# Altium project RedundantWirelessNode.PrjPcb
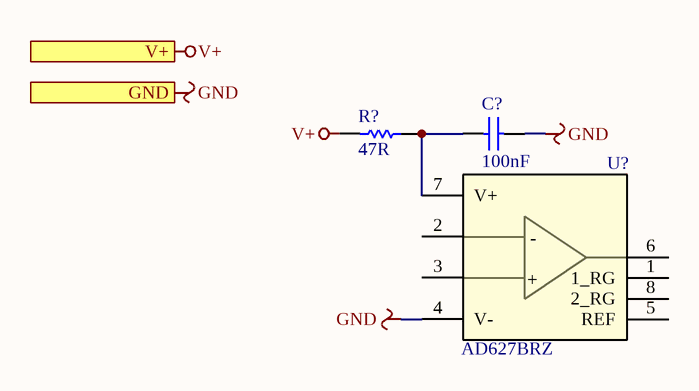
[diagram p0: Thermocouple channel.SchDoc]
7 sheets, 175 parts. Net scope: strictly hierarchical (ports join the sheet entries above them; power ports are local).
Sheets:
  Thermocouple channel.SchDoc
  Battery_2CELL.SchDoc
  TOP.SchDoc
    U_MCU = MCU.SchDoc
    U_MCU = MCU.SchDoc
    U_Battery_1CELL = Battery_1CELL.SchDoc
    U_Battery_1CELL = Battery_1CELL.SchDoc
  AblationChannel.SchDoc
  Analog.SchDoc

## Sheet Thermocouple channel.SchDoc
size A4

### Parts
(Parts that share a designator on the sheet are numbered #1, #2 ... from top to bottom, then left to right.)
C?#1  100nF  [S0603C]
R?#1  47R  [S0603R]
U?#1  AD627BRZ  [SOP-8_150mil]

### Ports
GND, V+

### Nets
GND: C?#1.1 U?#1.4(V-) ; port GND
V+: R?#1.2 ; port V+
NetC?#1_2: C?#1.2 R?#1.1 U?#1.7(V+)

Not connected (* = marked no-connect by the designer): U?#1 1(1_RG) 2(VIN-) 3(VIN+) 5(REF) 6(VOUT) 8(2_RG)

### Notes on the sheet
- (in symbol AD627BRZ) +

### Library data of the parts
C?#1 = 100nF/0603/50V: 精度 ±10% / 容值 100nF / 额定电压 50V / 温漂系数（介质材料) X7R; Manufacturer: FH(风华); A_Manufacturer: 元六; Code: 0603B104K500NT; A_Code: J CT41-0603-2R1-50V-104K; CompType: Capacitor; A_ComType: 二类电容; DistributorCode: C30926; Package: 0603
R?#1 = 47R/0603: 精度 ±1% / 温度系数 ±100ppm/℃ / 阻值 47Ω / 功率 0.1W; Manufacturer: FH(风华); A_Manufacturer: 718; Code: RS-03K47R0FT; A_Code: J-RM1608(0603)-K-B-47R-F; CompType: Resistor; A_ComType: RM型片式膜固定电阻器; DistributorCode: C140087; Package: 0603
U?#1 = AD627BRZ: 增益带宽积（GBP） 80kHz(-3dB) / 放大器组数 1 / 输出类型 Rail-to-Rail / 运放类型 Instrumentation / 各通道功耗 - / 压摆率（SR） 0.06 V/us / 工作温度 -40℃~85℃ / 电源电压 2.2V ~ 36V, ±1.1V ~ 18V; Manufacturer: TI(德州仪器); CompType: 运放; DistributorCode: C19137; Package: SOIC-8_150mil; Code: AD627BRZ; A_Code: -; A_Manufacturer: -; A_ComType: -

## Sheet Battery_2CELL.SchDoc
size A4
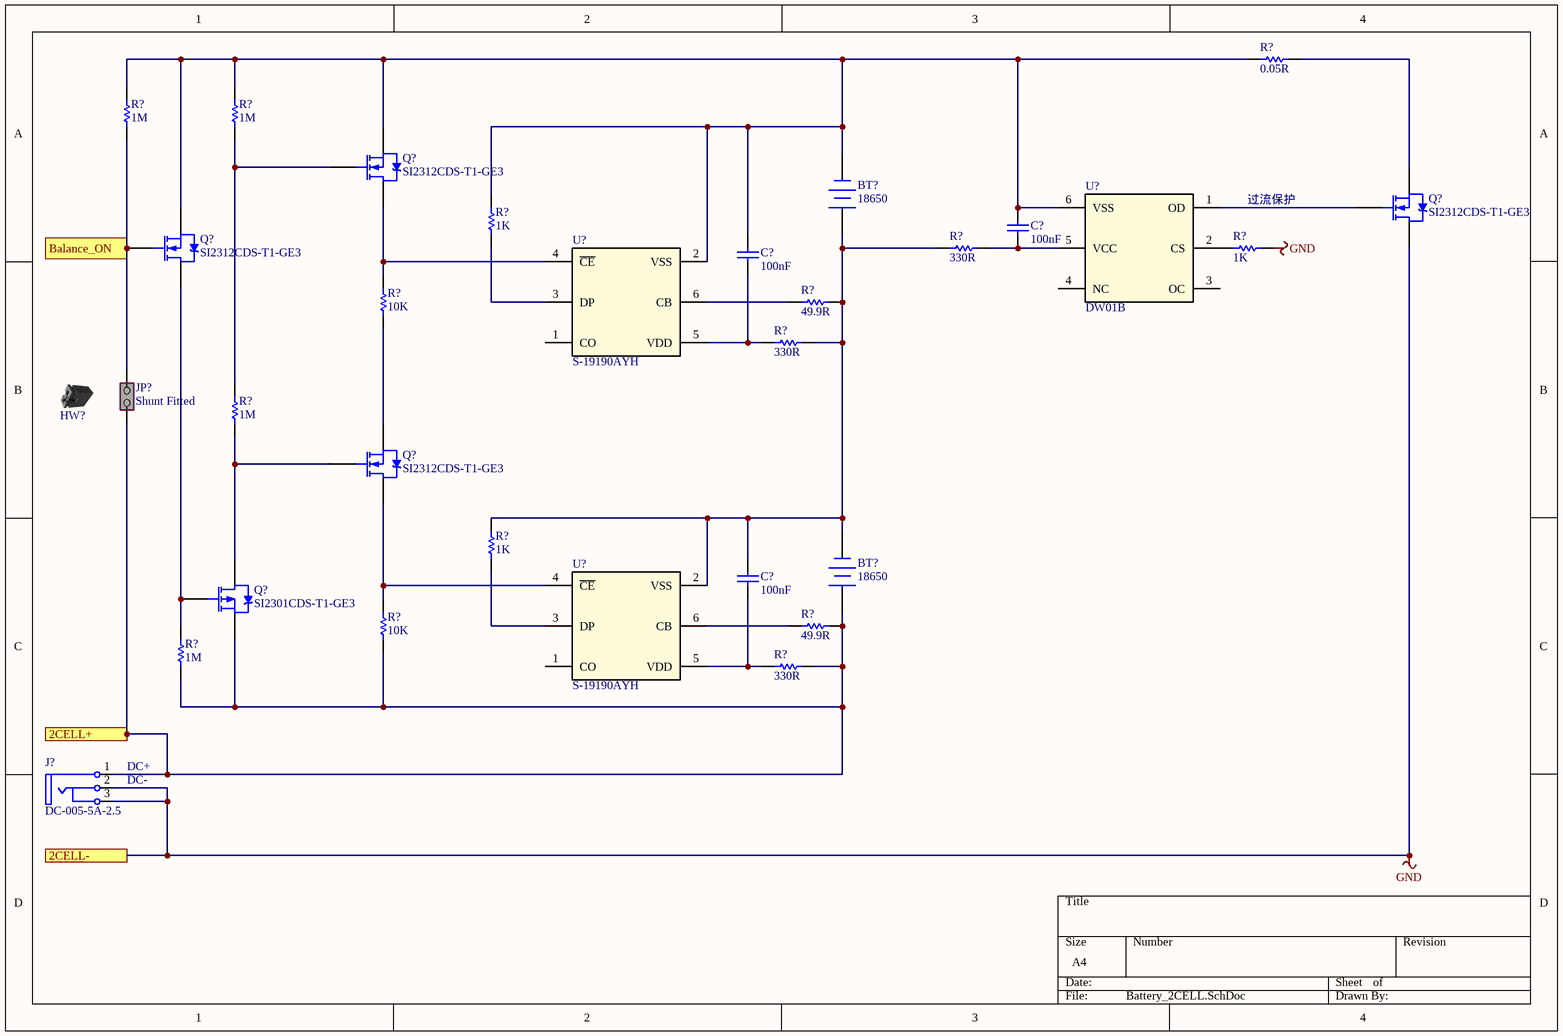
[diagram p1: Battery_2CELL.SchDoc]

### Parts
(Parts that share a designator on the sheet are numbered #1, #2 ... from top to bottom, then left to right.)
BT?#1  18650  [DIP-18650]
BT?#2  18650  [DIP-18650]
C?#2  100nF  [S0603C]
C?#3  100nF  [S0603C]
C?#4  100nF  [S0603C]
HW?  SHUNT  (value not drawn)  (mechanical)
J?  DC-005-5A-2.5  [DC-5.5X2.5]
JP?  Shunt Fitted  [CON_SAMTEC_TSW-102-07-G-S]
Q?#1  SI2312CDS-T1-GE3  [SOT-23(SOT-23-3)]
Q?#2  SI2312CDS-T1-GE3  [SOT-23(SOT-23-3)]
Q?#3  SI2312CDS-T1-GE3  [SOT-23(SOT-23-3)]
Q?#4  SI2312CDS-T1-GE3  [SOT-23(SOT-23-3)]
Q?#5  SI2301CDS-T1-GE3  [SOT-23(SOT-23-3)]
R?#2  0.05R  [S0805R]
R?#3  1M  [S0603R]
R?#4  1M  [S0603R]
R?#5  1K  [S0603R]
R?#6  330R  [S0603R]
R?#7  1K  [S0603R]
R?#8  10K  [S0603R]
R?#9  49.9R  [R1812]
R?#10  330R  [S0603R]
R?#11  1M  [S0603R]
R?#12  1K  [S0603R]
R?#13  10K  [S0603R]
R?#14  49.9R  [R1812]
R?#15  1M  [S0603R]
R?#16  330R  [S0603R]
U?#2  DW01B  [USOT23-6]
U?#3  S-19190AYH  [USOT23-6]
U?#4  S-19190AYH  [USOT23-6]

### Ports
2CELL+, 2CELL-, Balance_ON

### Nets
GND: J?.2(DC-) J?.3(DC-) Q?#2.3(D) R?#7.2 ; port 2CELL-
NetBT?#1_1: BT?#1.1(+) BT?#2.2(-) C?#4.2 R?#6.1 R?#9.2 R?#10.1 R?#12.2 U?#4.2(VSS)
NetBT?#1_2: BT?#1.2(-) C?#2.1 C?#3.2 Q?#1.2(S) Q?#3.2(S) R?#2.1 R?#3.2 R?#4.2 R?#5.2 U?#2.6(VSS) U?#3.2(VSS)
NetBT?#2_1: BT?#2.1(+) J?.1(DC+) JP?.1(COMMON) Q?#5.2(S) R?#13.1 R?#14.2 R?#15.1 R?#16.1 ; port 2CELL+
NetC?#2_2: C?#2.2 R?#6.2 U?#2.5(VCC)
NetC?#3_1: C?#3.1 R?#10.2 U?#3.5(VDD)
NetC?#4_1: C?#4.1 R?#16.2 U?#4.5(VDD)
NetJP?_2: JP?.2(NO) Q?#3.1(G) R?#3.1 ; port Balance_ON
NetQ?#1_1: Q?#1.1(G) R?#4.1 R?#11.2
NetQ?#1_3: Q?#1.3(D) R?#8.2 U?#3.4(~{CE})
NetQ?#2_1: Q?#2.1(G) U?#2.1(OD)
NetQ?#2_2: Q?#2.2(S) R?#2.2
NetQ?#3_3: Q?#3.3(D) Q?#5.1(G) R?#15.2
NetQ?#4_1: Q?#4.1(G) Q?#5.3(D) R?#11.1
NetQ?#4_2: Q?#4.2(S) R?#8.1
NetQ?#4_3: Q?#4.3(D) R?#13.2 U?#4.4(~{CE})
NetR?#5_1: R?#5.1 U?#3.3(DP)
NetR?#7_1: R?#7.1 U?#2.2(CS)
NetR?#9_1: R?#9.1 U?#3.6(CB)
NetR?#12_1: R?#12.1 U?#4.3(DP)
NetR?#14_1: R?#14.1 U?#4.6(CB)

Not connected (* = marked no-connect by the designer): U?#2 3(OC) 4(NC); U?#3 1(CO); U?#4 1(CO)

### Notes on the sheet
- 过流保护
- (near J?) DC+
- (near J?) DC-

### Library data of the parts
BT?#1 BT?#2 = Battery_18650_DIP: 18650单节直插电池仓; CompType: 电池盒/电池座; Code: DIP-18650; DistributorCode: -; Manufacturer: -; Package: DIP; A_Code: -; A_ComType: -; A_Manufacturer: -
C?#2-C?#4 = 100nF/0603/50V: as C?#1 on sheet Thermocouple channel; DistributorCode: C30926; Package: 0603
HW? = SHUNT: SHUNT 2.54mm BLACK; Internal_Part_Number: MCD-00043; Manufacturer_Part_Number: SNT-100-BK-G; Manufacturer: SAMTEC; Part_Type: Mechanical; Provided_By: Subcon; Initial_Board_Reference: MB1274; ECCN_US: n/a; ECCN_EU: n/a; ComponentLink1Description: Samtec_Shunt_Jumper_SNT100.pdf; Status: Released; ComponentLink1URL: http://tunmcdsvn.tun.st.com/Component_Datasheet_Library/Trunk/Connectors/Samtec_Shunt_Jumper_SNT100
J? = DC-005-5A-2.5: 连接器类型 插孔 / 触点外径 6.5mm / 安装特性 - / 电流额定值 5A / 产品类型 DC电源插座 / 公母 公头 / 安装类型 通孔，直角 / 触点内径 2.5mm / 电压额定值 24V; Manufacturer: XKB Connectivity(中国星坤); CompType: 连接器; Code: DC-005-5A-2.5; DistributorCode: C381115; Package: DC电源插座; A_Code: -; A_ComType: -; A_Manufacturer: -
JP? = MCD-00683: Header, 2x1, 2,54mm, VR, TH, Height 5.84mm/2.54mm - Shunt Fitted by default; Part_Type: Connector; Manufacturer_Part_Number: TSW-102-07-x-S; Manufacturer: SAMTEC; Provided_By: Subcon; Initial_Board_Reference: MB1331; Internal_Part_Number: MCD-00683; Status: Released; ComponentLink1Description: Samtec_connector_TSW-HTSW-series.pdf; ComponentLink1URL: http://tunmcdsvn.tun.st.com/Component_Datasheet_Library/Trunk/Connectors/Samtec_TSW-HTSW-series; ECCN_US: n/a; ECCN_EU: n/a; Value: Shunt Fitted
Q?#1-Q?#4 = SI2312CDS-T1-GE3: 漏源电压（Vdss） 20V / 连续漏极电流（Id）（25°C 时） 6A(Tc) / 栅源极阈值电压 1V @ 250uA / 漏源导通电阻 31.8mΩ @ 5A,4.5V / 最大功率耗散（Ta=25°C） 2.1W(Tc) / 类型 N沟道; Manufacturer: VISHAY(威世); CompType: MOS(场效应管); A_Code: -; A_Manufacturer: -; Code: SI2312CDS-T1-GE3; DistributorCode: C142518; Package: SOT-23-3; A_ComType: -
Q?#5 = SI2301CDS-T1-GE3: 漏源电压（Vdss） -20V / 连续漏极电流（Id）（25°C 时） 3.1A / 栅源极阈值电压 1V @ 250uA / 漏源导通电阻 112mΩ @ 2.8A,4.5V / 最大功率耗散（Ta=25°C） 860mW / 类型 P沟道; Manufacturer: VISHAY(威世); CompType: MOS(场效应管); A_Code: -; A_Manufacturer: -; Code: SI2301CDS-T1-GE3; DistributorCode: C10487; Package: SOT-23-3; A_ComType: -
R?#2 = 0.05R/0805: 阻值（欧姆） 0.05Ω / 精度 ±1% / 功率 1/4W / 温度系数 ±400ppm/°C; Manufacturer: UNI-ROYAL(厚声); A_Manufacturer: 718; Code: CS05W4F500MT5E; CompType: Resistor; A_ComType: RM型片式膜固定电阻器; DistributorCode: C270863; Package: 0805; A_Code: -
R?#3 R?#4 R?#11 R?#15 = 1M/0603: 阻值 1MΩ / 精度 ±1% / 温度系数 ±100ppm/℃ / 功率 0.1W /; Manufacturer: FH(风华); A_Manufacturer: 718; Code: RS-03K1004FT; A_Code: J-RM1608(0603)-K-B-1M-F; CompType: Resistor; A_ComType: RM型片式膜固定电阻器; DistributorCode: C136593; Package: 0603
R?#5 R?#7 R?#12 = 1K/0603: 精度 ±1% / 温度系数 ±100ppm/℃ / 阻值 1kΩ / 功率 0.1W; Manufacturer: FH(风华); A_Manufacturer: 718; Code: RS-03K1001FT; A_Code: J-RM1608(0603)-K-B-1K-F; CompType: Resistor; A_ComType: RM型片式膜固定电阻器; DistributorCode: C115325; Package: 0603
R?#6 R?#10 R?#16 = 330R/0603: 精度 ±1% / 温度系数 ±100ppm/℃ / 阻值 330Ω / 功率 0.1W; Manufacturer: FH(风华); A_Manufacturer: 718; Code: RS-03K3300FT; A_Code: J-RM1608(0603)-K-B-330R-F; CompType: Resistor; A_ComType: RM型片式膜固定电阻器; DistributorCode: C125768; Package: 0603
R?#8 R?#13 = 10K/0603: 精度 ±1% / 温度系数 ±100ppm/℃ / 阻值 10kΩ / 功率 0.1W; Manufacturer: FH(风华); A_Manufacturer: 718; Code: RS-03K1002FT; A_Code: J-RM1608(0603)-K-B-10K-F; CompType: Resistor; A_ComType: RM型片式膜固定电阻器; DistributorCode: C115324; Package: 0603
R?#9 R?#14 = 49.9R/1812: 精度 ±1% / 功率 0.75W / 温度系数 ±100ppm/℃ / 阻值 49.9Ω; Manufacturer: UNI-ROYAL(厚声); A_Manufacturer: 718; Code: 181207F499JT4E; CompType: Resistor; A_ComType: RM型片式膜固定电阻器; DistributorCode: C422079; Package: 0805; A_Code: -
U?#2 = DW01B: Manufacturer: BLUE ROCKET(蓝箭); CompType: 电池保护芯片; Code: DW01B; DistributorCode: C305480; Package: SOT23-6
U?#3 U?#4 = S-19190AYH: 均衡电压4.15V;过充电压4.275V; Manufacturer: 艾普凌科; CompType: 电池保护芯片; Code: S-19190AYH; DistributorCode: -; Package: SOT23-6

## Sheet TOP.SchDoc
size A4; DrawnBy: YuJian; SheetNumber: 1; SheetTotal: 6
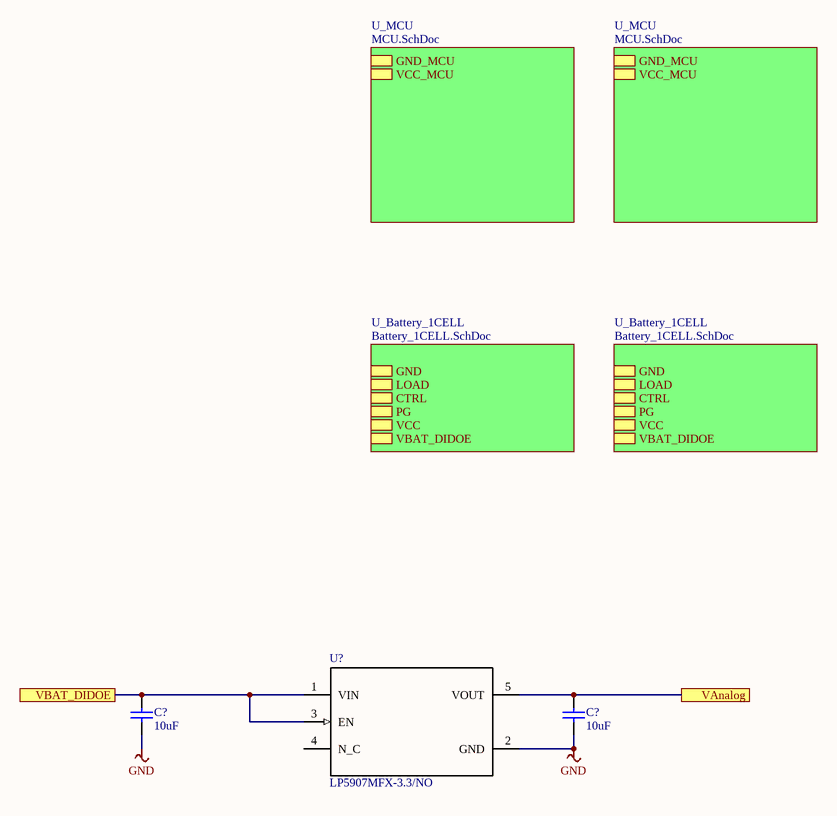
[diagram p2: TOP.SchDoc]

### Parts
(Parts that share a designator on the sheet are numbered #1, #2 ... from top to bottom, then left to right.)
C?#5  10uF  [S0805C]
C?#6  10uF  [S0805C]
U?#5  LP5907MFX-3.3/NO  [SOT23-5]

### Sub-sheets
U_Battery_1CELL = Battery_1CELL.SchDoc: LOAD, CTRL, PG, VCC, VBAT_DIDOE, GND
U_Battery_1CELL = Battery_1CELL.SchDoc: LOAD, CTRL, PG, VCC, VBAT_DIDOE, GND
U_MCU = MCU.SchDoc: GND_MCU, VCC_MCU
U_MCU = MCU.SchDoc: GND_MCU, VCC_MCU

### Ports
VAnalog, VBAT_DIDOE

### Nets
GND: C?#5.1 C?#6.1 U?#5.2(GND)
NetC?#5_2: C?#5.2 U?#5.1(VIN) U?#5.3(EN) ; port VBAT_DIDOE
NetC?#6_2: C?#6.2 U?#5.5(VOUT) ; port VAnalog

Not connected (* = marked no-connect by the designer): U?#5 4(N_C)

### Library data of the parts
C?#5 C?#6 = 10uF/0805/16V: 精度 ±10% / 容值 10uF / 额定电压 16V / 温漂系数（介质材料) X7R; Manufacturer: FH(风华); A_Manufacturer: 元六; Code: 0805B106K160NT; CompType: Capacitor; A_Code: J CT41-0805-2R2-16V-106M; A_ComType: 二类电容; Package: 0805; DistributorCode: C92341
U?#5 = LP5907MFX-3.3/NO: 线性稳压器(LDO) / 工作电源电流(Max) 425μA / 最大输入电压 5.5V / 压降(max) 250mV @ 250mA / 输出电压(可调) - / 静态电流(Iq) - / 最大输出电流 250mA / 输出配置 正 / 纹波抑制(PSRR) 90dB ~ 60dB(100Hz ~ 100kHz) / 输出类型 固定 / 输出通道数 1 / 工作温度 -40°C ~ 125°C / 使能脚 - / 输出电压(固定) 3.3V; Manufacturer: TI(德州仪器); Code: LP5907MFX-3.3/NOPB; CompType: LDO; DistributorCode: C80670; Package: SOT-23-5

## Sheet MCU.SchDoc
size A4
Used 2 times, as channels U_MCU, U_MCU. Parts and nets are listed once, with the designators drawn on the sheet.
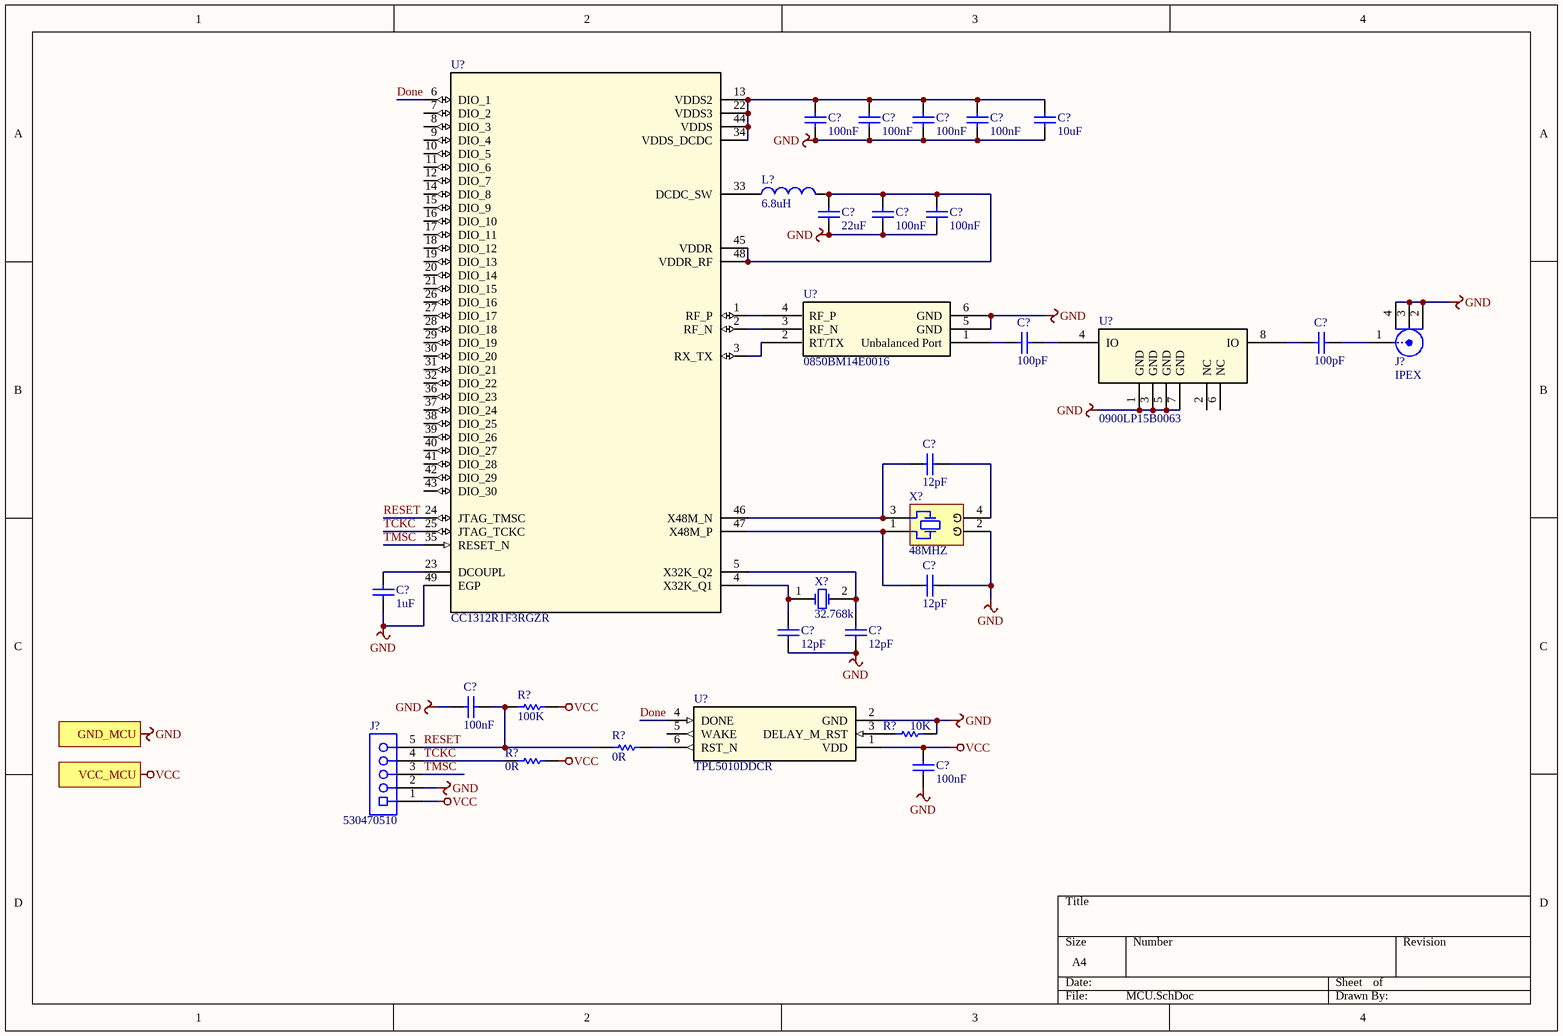
[diagram p3: MCU.SchDoc]

### Parts
(Parts that share a designator on the sheet are numbered #1, #2 ... from top to bottom, then left to right.)
C?#1  100nF  [S0603C]
C?#2  100nF  [S0603C]
C?#3  100nF  [S0603C]
C?#4  100nF  [S0603C]
C?#5  10uF  [S0805C]
C?#6  22uF  [S0805C]
C?#7  100nF  [S0603C]
C?#8  100nF  [S0603C]
C?#9  100pF  [S0402C]
C?#10  100pF  [S0402C]
C?#11  12pF  [S0603C]
C?#12  12pF  [S0603C]
C?#13  1uF  [S0603C]
C?#14  12pF  [S0603C]
C?#15  12pF  [S0603C]
C?#16  100nF  [S0603C]
C?#17  100nF  [S0603C]
J?#1  IPEX  [molex-73412]
J?#2  530470510  [1.25mm_p5]
L?  6.8uH  [S0805L]
R?#1  100K  [S0603R]
R?#2  10K  [S0603R]
R?#3  0R  [S0603R]
R?#4  0R  [S0603R]
U?#1  0850BM14E0016  [6P0603]
U?#2  CC1312R1F3RGZR  [RGZ0048A]
U?#3  0900LP15B0063  [8P0805]
U?#4  TPL5010DDCR  [DDC0006A_N]
X?#1  48MHZ  [SMD-2016]
X?#2  32.768k  [SMD-2012]

### Ports
GND_MCU, VCC_MCU

### Nets
GND: C?#1.1 C?#2.1 C?#3.1 C?#4.1 C?#5.1 C?#6.1 C?#7.1 C?#8.1 C?#12.1 C?#13.1 C?#14.1 C?#15.1 C?#16.2 C?#17.1 J?#1.2 J?#1.3 J?#1.4 J?#2.2 R?#2.1 U?#1.5(GND) U?#1.6(GND) U?#2.49(EGP) U?#3.1(GND) U?#3.3(GND) U?#3.5(GND) U?#3.7(GND) U?#4.2(GND) X?#1.2(GND) ; port GND_MCU
VCC: C?#17.2 J?#2.1 R?#1.2 R?#4.1 U?#4.1(VDD) ; port VCC_MCU
Done: U?#2.6(DIO_1) U?#4.4(DONE)
RESET: C?#16.1 J?#2.5 R?#1.1 R?#3.2 U?#2.24(JTAG_TMSC)
TCKC: J?#2.4 R?#4.2 U?#2.25(JTAG_TCKC)
TMSC: J?#2.3 U?#2.35(RESET_N)
NetC?#1_2: C?#1.2 C?#2.2 C?#3.2 C?#4.2 C?#5.2 U?#2.13(VDDS2) U?#2.22(VDDS3) U?#2.34(VDDS_DCDC) U?#2.44(VDDS)
NetC?#6_2: C?#6.2 C?#7.2 C?#8.2 L?.2 U?#2.45(VDDR) U?#2.48(VDDR_RF)
NetC?#9_1: C?#9.1 U?#1.1(Unbalanced_Port)
NetC?#9_2: C?#9.2 U?#3.4(IO)
NetC?#10_1: C?#10.1 U?#3.8(IO)
NetC?#10_2: C?#10.2 J?#1.1
NetC?#11_1: C?#11.1 X?#1.4(GND)
NetC?#11_2: C?#11.2 U?#2.46(X48M_N) X?#1.3
NetC?#12_2: C?#12.2 U?#2.47(X48M_P) X?#1.1
NetC?#13_2: C?#13.2 U?#2.23(DCOUPL)
NetC?#14_2: C?#14.2 U?#2.4(X32K_Q1) X?#2.1(OSC1)
NetC?#15_2: C?#15.2 U?#2.5(X32K_Q2) X?#2.2(OSC2)
NetL?_1: L?.1 U?#2.33(DCDC_SW)
NetR?#2_2: R?#2.2 U?#4.3(DELAY_M_RST)
NetR?#3_1: R?#3.1 U?#4.6(RST_N)
NetU?#1_2: U?#1.2(RT/TX) U?#2.3(RX_TX)
NetU?#1_3: U?#1.3(RF_N) U?#2.2(RF_N)
NetU?#1_4: U?#1.4(RF_P) U?#2.1(RF_P)

Not connected (* = marked no-connect by the designer): U?#2 7(DIO_2) 8(DIO_3) 9(DIO_4) 10(DIO_5) 11(DIO_6) 12(DIO_7) 14(DIO_8) 15(DIO_9) 16(DIO_10) 17(DIO_11) 18(DIO_12) 19(DIO_13) 20(DIO_14) 21(DIO_15) 26(DIO_16) 27(DIO_17) 28(DIO_18) 29(DIO_19) 30(DIO_20) 31(DIO_21) 32(DIO_22) 36(DIO_23) 37(DIO_24) 38(DIO_25) 39(DIO_26) 40(DIO_27) 41(DIO_28) 42(DIO_29) 43(DIO_30); U?#3 2(NC) 6(NC); U?#4 5(WAKE)

### Channels
U_MCU: designators C?=C?A#14 C?=C?A#15 C?=C?A#11 C?=C?A#12 C?=C?A#9 C?=C?A#10 C?=C?A#6 C?=C?A#7 C?=C?A#8 C?=C?A#1 C?=C?A#2 C?=C?A#3 C?=C?A#4 C?=C?A#5 C?=C?A#13 C?=C?A#16 C?=C?A#17 J?=J?A#1 J?=J?A#2 L?=L?A#1 R?=R?A#1 R?=R?A#4 R?=R?A#2 R?=R?A#3 U?=U?A#2 U?=U?A#1 U?=U?A#3 U?=U?A#4 X?=X?A#2 X?=X?A#1; ports GND_MCU=GND VCC_MCU=VCC
U_MCU: designators C?=C?B#14 C?=C?B#15 C?=C?B#11 C?=C?B#12 C?=C?B#9 C?=C?B#10 C?=C?B#6 C?=C?B#7 C?=C?B#8 C?=C?B#1 C?=C?B#2 C?=C?B#3 C?=C?B#4 C?=C?B#5 C?=C?B#13 C?=C?B#16 C?=C?B#17 J?=J?B#1 J?=J?B#2 L?=L?B#1 R?=R?B#1 R?=R?B#4 R?=R?B#2 R?=R?B#3 U?=U?B#2 U?=U?B#1 U?=U?B#3 U?=U?B#4 X?=X?B#2 X?=X?B#1; ports GND_MCU=GND VCC_MCU=VCC

### Notes on the sheet
- (in symbol FA-128 48.000000MHz 10pF ±10ppm) G

### Library data of the parts
C?#1-C?#4 C?#7 C?#8 C?#16 C?#17 = 100nF/0603/50V: as C?#1 on sheet Thermocouple channel; DistributorCode: C30926; Package: 0603
C?#5 = 10uF/0805/16V: as C?#5 on sheet TOP; Package: 0805; DistributorCode: C92341
C?#6 = 22uF/0805/16V: 精度 ±20% / 容值 22uF / 额定电压 16V / 温漂系数（介质材料) X5R; Manufacturer: FH(风华); A_Manufacturer: 元六; Code: 0805X226M160NT; A_Code: J CT41-0805-2R2-16V-226M; CompType: Capacitor; A_ComType: 二类电容; DistributorCode: C129302; Package: 0805
C?#9 C?#10 = 100pF/0402/50V: 精度 ±5% / 容值 100pF / 额定电压 50V / 温漂系数（介质材料) C0G; Manufacturer: FH(风华); A_Manufacturer: 元六; Code: 0402CG101J500NT; A_Code: J CC41-0402-CG-50V-101J; CompType: Capacitor; A_ComType: 一类电容; DistributorCode: C1546; Package: 0402
C?#11 C?#12 C?#14 C?#15 = 12pF/0603/50V: 精度 ±5% / 容值 12pF / 额定电压 50V / 温漂系数（介质材料) C0G; Manufacturer: FH(风华); A_Manufacturer: 元六; Code: 0603CG120J500NT; A_Code: J CC41-0603-CG-50V-120J; CompType: Capacitor; A_ComType: 一类电容; DistributorCode: C1642; Package: 0603
C?#13 = 1uF/0603/50V: 精度 ±10% / 容值 1uF / 额定电压 50V / 温漂系数（介质材料) X7R; Manufacturer: FH(风华); A_Manufacturer: 元六; Code: 0603B105K500NT; A_Code: J CT41-0603-2R1-50V-105M; CompType: Capacitor; A_ComType: 二类电容; DistributorCode: C90540; Package: 0603
J?#1 = 73412-0110: RF同轴连接器（天线座）; Manufacturer: MOLEX; Code: 734120110; CompType: IPEX插座; DistributorCode: C434806; Package: SMD
J?#2 = Molex-530470510: MX1.25 直插 镀锡 5P 针座; Manufacturer: MOLEX; CompType: 连接器; Code: 530470510; DistributorCode: C471412; Package: 1.25mm 5p; A_Code: -; A_ComType: -; A_Manufacturer: -
L? = 6.8uH/0805: 精度 ±10% / 电感值 6.8uH / 直流电阻（内阻） 250mΩ / 额定电流 250mA; Manufacturer: FH(风华); A_Manufacturer: 振华富; Code: CMP201209XD6R8KT; A_Code: PI2012F6R8; CompType: Inductor; DistributorCode: C139247; Package: 0805; A_ComType: -
R?#1 = 100K/0603: 精度 ±1% / 阻值 100kΩ / 温度系数 ±100ppm/℃ / 功率 0.1W; Manufacturer: FH(风华); A_Manufacturer: 718; Code: RS-03K1003FT; A_Code: J-RM1608(0603)-K-B-100K-F; CompType: Resistor; A_ComType: RM型片式膜固定电阻器; DistributorCode: C115320; Package: 0603
R?#2 = 10K/0603: as R?#8 on sheet Battery_2CELL; DistributorCode: C115324; Package: 0603
R?#3 R?#4 = 0R/0603: 精度 ±1% / 阻值 0Ω / 功率 0.1W; Manufacturer: FH(风华); A_Manufacturer: 718; Code: RS-03000FT; A_Code: J-RM1608(0603)-K-B-0R-F; CompType: Resistor; A_ComType: RM型片式膜固定电阻器; DistributorCode: C136582; Package: 0603
U?#1 = 0850BM14E0016: 770 - 860 860 - 928MHz / -40°C to +85°C / Pmax 2W; Manufacturer: Johanson Technology; CompType: Balun; Code: 0850BM14E0016; DistributorCode: -; Package: 6P0603; A_Code: -; A_ComType: -; A_Manufacturer: -
U?#2 = CC1312R1F3RGZR: RF-MCU; Manufacturer: TI(德州仪器); CompType: MCU; DistributorCode: C543014; Package: VQFN-48; Code: CC1312R1F3RGZR; A_Code: -; A_ComType: -; A_Manufacturer: -
U?#3 = 0900LP15B0063: 863 - 960MHz / -40 to +85°C / 3Fo Attenuation (2589-2784MHz) 50dB / 2Fo Attenuation (1726-1856MHz) 59dB /; Manufacturer: Johanson Technology; CompType: 低通; Code: 0900LP15B0063; DistributorCode: *; Package: 8P0805
U?#4 = TPL5010DDCR: 看门狗; Manufacturer: TI(德州仪器); Code: TPL5010DDCR; DistributorCode: C473912; Package: SOT23-Thin-6; CompType: 看门狗; A_Code: -; A_ComType: -; A_Manufacturer: -
X?#1 = FA-128 48.000000MHz 10pF ±10ppm: Q22FA12800150 / 等效串联电阻（ESR） 60Ω / 晶振类型 无源贴片晶振 / 主频 48MHz / 频率公差 ±10ppm / 负载电容值 10pF / 工作温度 -40℃ ~ +85℃; Manufacturer: EPSON(爱普生); CompType: 晶振; Code: FA-128 48.000000MHz 10pF ±10ppm; DistributorCode: C255900; Package: SMD-2016; A_Code: -; A_ComType: -; A_Manufacturer: -
X?#2 = X1A000061002100: X1A000061002100 / 等效串联电阻（ESR） 90kΩ / 晶振类型 无源贴片晶振 / 主频 32.768KHz / 频率公差 ±20ppm / 负载电容值 6pF / 工作温度 -40℃ ~ +85℃; Manufacturer: EPSON(爱普生); Code: FC-12M 32.768kHz 6pF ±20ppm; CompType: 晶振; DistributorCode: C255767; Package: SMD-2012; A_Code: -; A_ComType: -; A_Manufacturer: -

## Sheet Battery_1CELL.SchDoc
size A4
Used 2 times, as channels U_Battery_1CELL, U_Battery_1CELL. Parts and nets are listed once, with the designators drawn on the sheet.
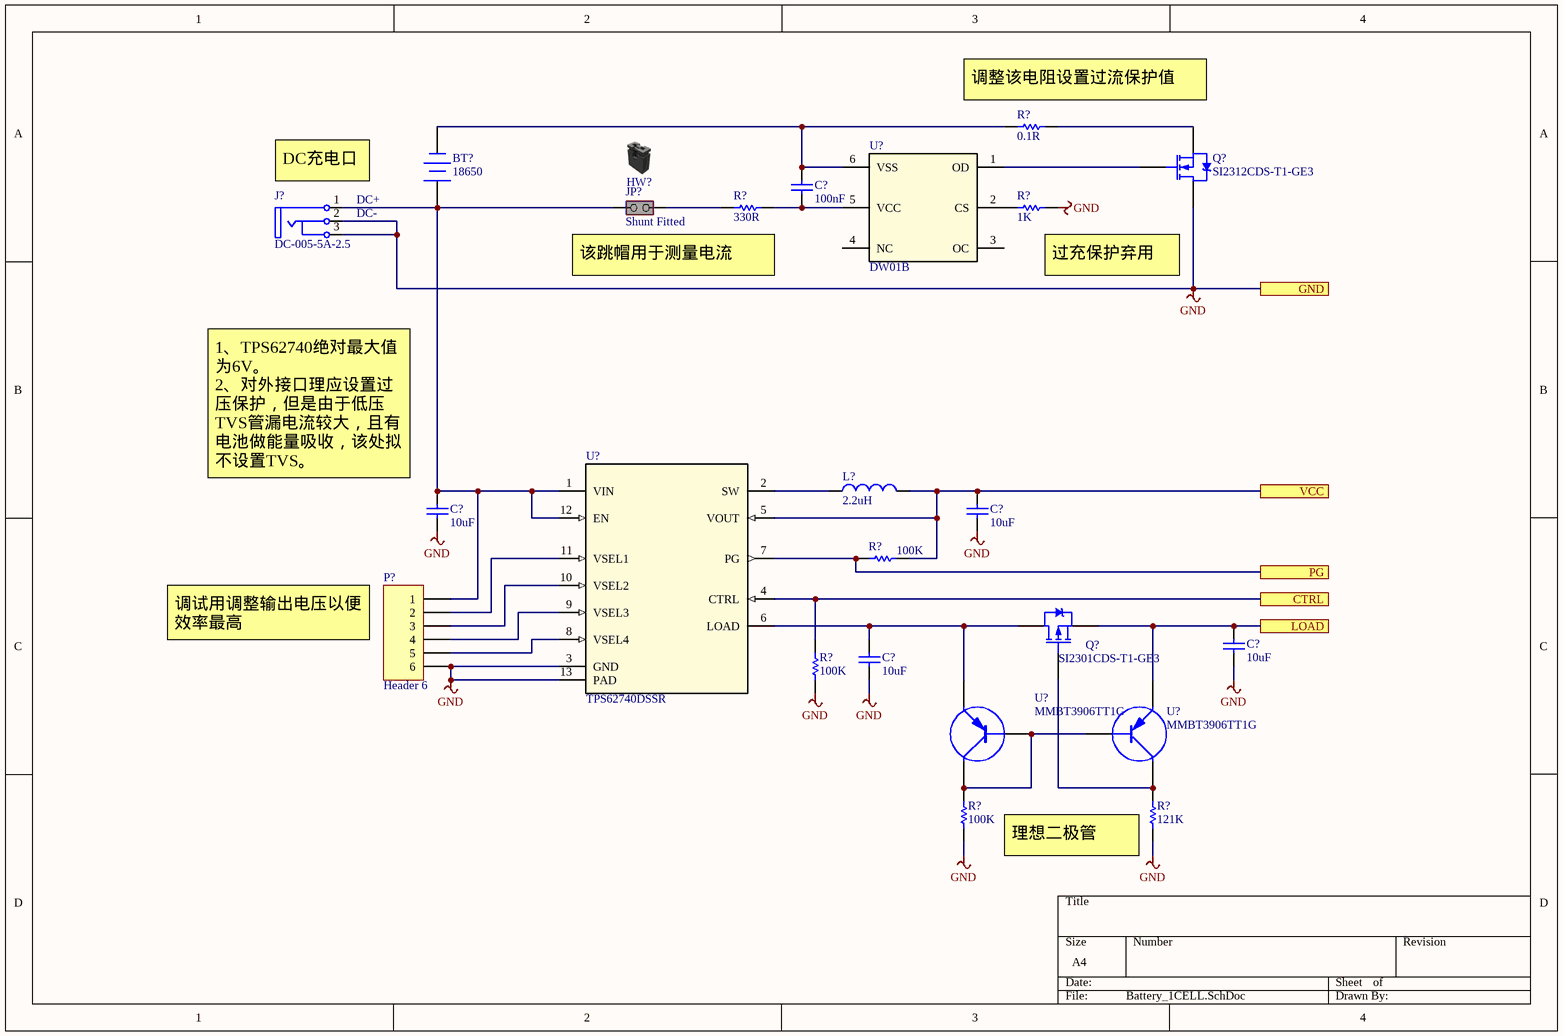
[diagram p4: Battery_1CELL.SchDoc]

### Parts
(Parts that share a designator on the sheet are numbered #1, #2 ... from top to bottom, then left to right.)
BT?  18650  [DIP-18650]
C?#1  100nF  [S0603C]
C?#2  10uF  [S0805C]
C?#3  10uF  [S0805C]
C?#4  10uF  [S0805C]
C?#5  10uF  [S0805C]
HW?  SHUNT  (value not drawn)  (mechanical)
J?  DC-005-5A-2.5  [DC-5.5X2.5]
JP?  Shunt Fitted  [CON_SAMTEC_TSW-102-07-G-S]
L?  2.2uH  [S0805L]
P?  Header 6  [CP1X6]
Q?#1  SI2312CDS-T1-GE3  [SOT-23(SOT-23-3)]
Q?#2  SI2301CDS-T1-GE3  [SOT-23(SOT-23-3)]
R?#1  0.1R  [S0805R]
R?#2  330R  [S0603R]
R?#3  1K  [S0603R]
R?#4  100K  [S0603R]
R?#5  100K  [S0603R]
R?#6  100K  [S0603R]
R?#7  121K  [S0603R]
U?#1  DW01B  [USOT23-6]
U?#2  TPS62740DSSR  [DSS0012A]
U?#3  MMBT3906TT1G  [SOT-23(SOT-23-3)]
U?#4  MMBT3906TT1G  [SOT-23(SOT-23-3)]

### Ports
CTRL, GND, LOAD, PG, VCC

### Nets
GND: C?#2.1 C?#3.1 C?#4.1 C?#5.1 J?.2(DC-) J?.3(DC-) P?.6 Q?#1.3(D) R?#3.2 R?#5.1 R?#6.1 R?#7.1 U?#2.3(GND) U?#2.13(PAD) ; port GND
CTRL: R?#5.2 U?#2.4(CTRL) ; port CTRL
LOAD: C?#4.2 Q?#2.2(S) U?#4.2(E) ; port LOAD
PG: R?#4.1 U?#2.7(PG) ; port PG
VCC: C?#3.2 L?.2 R?#4.2 U?#2.5(VOUT) ; port VCC
NetBT?_1: BT?.1(+) C?#2.2 J?.1(DC+) JP?.1(COMMON) P?.1 U?#2.1(VIN) U?#2.12(EN)
NetBT?_2: BT?.2(-) C?#1.1 R?#1.1 U?#1.6(VSS)
NetC?#1_2: C?#1.2 R?#2.2 U?#1.5(VCC)
NetC?#5_2: C?#5.2 Q?#2.3(D) U?#2.6(LOAD) U?#3.2(E)
NetJP?_2: JP?.2(NO) R?#2.1
NetL?_1: L?.1 U?#2.2(SW)
NetP?_2: P?.2 U?#2.11(VSEL1)
NetP?_3: P?.3 U?#2.10(VSEL2)
NetP?_4: P?.4 U?#2.9(VSEL3)
NetP?_5: P?.5 U?#2.8(VSEL4)
NetQ?#1_1: Q?#1.1(G) U?#1.1(OD)
NetQ?#1_2: Q?#1.2(S) R?#1.2
NetQ?#2_1: Q?#2.1(G) R?#7.2 U?#4.3(C)
NetR?#3_1: R?#3.1 U?#1.2(CS)
NetR?#6_2: R?#6.2 U?#3.1(B) U?#3.3(C) U?#4.1(B)

Not connected (* = marked no-connect by the designer): U?#1 3(OC) 4(NC)

### Channels
U_Battery_1CELL: designators BT?=BT?A C?=C?A#18 C?=C?A#19 C?=C?A#20 C?=C?A#22 C?=C?A#21 HW?=HW?A J?=J?A#3 JP?=JP?A L?=L?A#2 P?=P?A Q?=Q?A#1 Q?=Q?A#2 R?=R?A#7 R?=R?A#6 R?=R?A#5 R?=R?A#8 R?=R?A#9 R?=R?A#10 R?=R?A#11 U?=U?A#5 U?=U?A#6 U?=U?A#7 U?=U?A#8; ports CTRL=NetR?A#9_2 GND=GND LOAD=NetC?A#21_2 PG=NetR?A#8_1 VCC=NetC?A#20_2
U_Battery_1CELL: designators BT?=BT?B C?=C?B#18 C?=C?B#19 C?=C?B#20 C?=C?B#22 C?=C?B#21 HW?=HW?B J?=J?B#3 JP?=JP?B L?=L?B#2 P?=P?B Q?=Q?B#1 Q?=Q?B#2 R?=R?B#7 R?=R?B#6 R?=R?B#5 R?=R?B#8 R?=R?B#9 R?=R?B#10 R?=R?B#11 U?=U?B#5 U?=U?B#6 U?=U?B#7 U?=U?B#8; ports CTRL=NetR?B#9_2 GND=GND LOAD=NetC?B#21_2 PG=NetR?B#8_1 VCC=NetC?B#20_2

### Notes on the sheet
- (near R?#1) 调整该电阻设置过流保护值
- (near J?) DC充电口
- (near J?) DC+
- (near J?) DC-
- 该跳帽用于测量电流
- (near R?#3) 过充保护弃用
- (near C?#2) 1、TPS62740绝对最大值为6V。
  2、对外接口理应设置过压保护，但是由于低压TVS管漏电流较大，且有电池做能量吸收，该处拟不设置TVS。
- 调试用调整输出电压以便效率最高
- (near R?#7) 理想二极管

### Library data of the parts
BT? = Battery_18650_DIP: 18650单节直插电池仓; CompType: 电池盒/电池座; Code: DIP-18650; DistributorCode: -; Manufacturer: -; Package: DIP; A_Code: -; A_ComType: -; A_Manufacturer: -
C?#1 = 100nF/0603/50V: as C?#1 on sheet Thermocouple channel; DistributorCode: C30926; Package: 0603
C?#2-C?#5 = 10uF/0805/16V: as C?#5 on sheet TOP; Package: 0805; DistributorCode: C92341
HW? = SHUNT: as HW? on sheet Battery_2CELL; ECCN_US: n/a; ECCN_EU: n/a; ComponentLink1Description: Samtec_Shunt_Jumper_SNT100.pdf; Status: Released; ComponentLink1URL: http://tunmcdsvn.tun.st.com/Component_Datasheet_Library/Trunk/Connectors/Samtec_Shunt_Jumper_SNT100
J? = DC-005-5A-2.5: as J? on sheet Battery_2CELL; Code: DC-005-5A-2.5; DistributorCode: C381115; Package: DC电源插座; A_Code: -; A_ComType: -; A_Manufacturer: -
JP? = MCD-00683: as JP? on sheet Battery_2CELL; Internal_Part_Number: MCD-00683; Status: Released; ComponentLink1Description: Samtec_connector_TSW-HTSW-series.pdf; ComponentLink1URL: http://tunmcdsvn.tun.st.com/Component_Datasheet_Library/Trunk/Connectors/Samtec_TSW-HTSW-series; ECCN_US: n/a; ECCN_EU: n/a; Value: Shunt Fitted
L? = 2.2uH/0805: 精度 ±20% / 额定电流 800mA / 直流电阻（内阻） 230mΩ / 电感值 2.2uH; Manufacturer: TDK; A_Manufacturer: 振华富; Code: MLP2012S2R2MT0S1; A_Code: PI2012F2R2; CompType: Inductor; DistributorCode: C107322; Package: 0805; A_ComType: -
P? = Header 6: Header, 6-Pin; LatestRevisionDate: 17-Jul-2002; LatestRevisionNote: Re-released for DXP Platform.; Publisher: Altium Limited
Q?#1 = SI2312CDS-T1-GE3: as Q?#1 on sheet Battery_2CELL; A_Code: -; A_Manufacturer: -; Code: SI2312CDS-T1-GE3; DistributorCode: C142518; Package: SOT-23-3; A_ComType: -
Q?#2 = SI2301CDS-T1-GE3: as Q?#5 on sheet Battery_2CELL; A_Code: -; A_Manufacturer: -; Code: SI2301CDS-T1-GE3; DistributorCode: C10487; Package: SOT-23-3; A_ComType: -
R?#1 = 0.1R/0805: 阻值（欧姆） 0.1Ω / 精度 ±1% / 功率 1/3W / 温度系数 ±100ppm/°C; Manufacturer: UNI-ROYAL(厚声); A_Manufacturer: 718; Code: HP05W3F100LT5E; A_Code: J-RM2012(0805)-K-B-0.1R-F; CompType: Resistor; A_ComType: RM型片式膜固定电阻器; DistributorCode: C270842; Package: 0805
R?#2 = 330R/0603: as R?#6 on sheet Battery_2CELL; DistributorCode: C125768; Package: 0603
R?#3 = 1K/0603: as R?#5 on sheet Battery_2CELL; DistributorCode: C115325; Package: 0603
R?#4-R?#6 = 100K/0603: as R?#1 on sheet MCU; DistributorCode: C115320; Package: 0603
R?#7 = 121K/0603: 精度 ±1% / 阻值 121kΩ / 温度系数 ±100ppm/℃ / 功率 0.1W; Manufacturer: FH(风华); A_Manufacturer: 718; Code: RS-03K1213FT; A_Code: J-RM1608(0603)-K-B-121K-F; CompType: Resistor; DistributorCode: C321700; Package: 0603
U?#1 = DW01B: as U?#2 on sheet Battery_2CELL; Code: DW01B; DistributorCode: C305480; Package: SOT23-6
U?#2 = TPS62740DSSR: DCDC; Manufacturer: TI(德州仪器); CompType: 电源芯片; DistributorCode: C128606; Package: DSS0012A; Code: TPS62740DSSR
U?#3 U?#4 = MMBT3906TT1G: 额定功率 200mW / 集电极电流Ic 200mA / 集射极击穿电压Vce 40V / 晶体管类型 PNP; Manufacturer: ON(安森美); Code: MMBT3906TT1G; DistributorCode: C82042; Package: SOT23-3; CompType: PNP

## Sheet AblationChannel.SchDoc
size A4
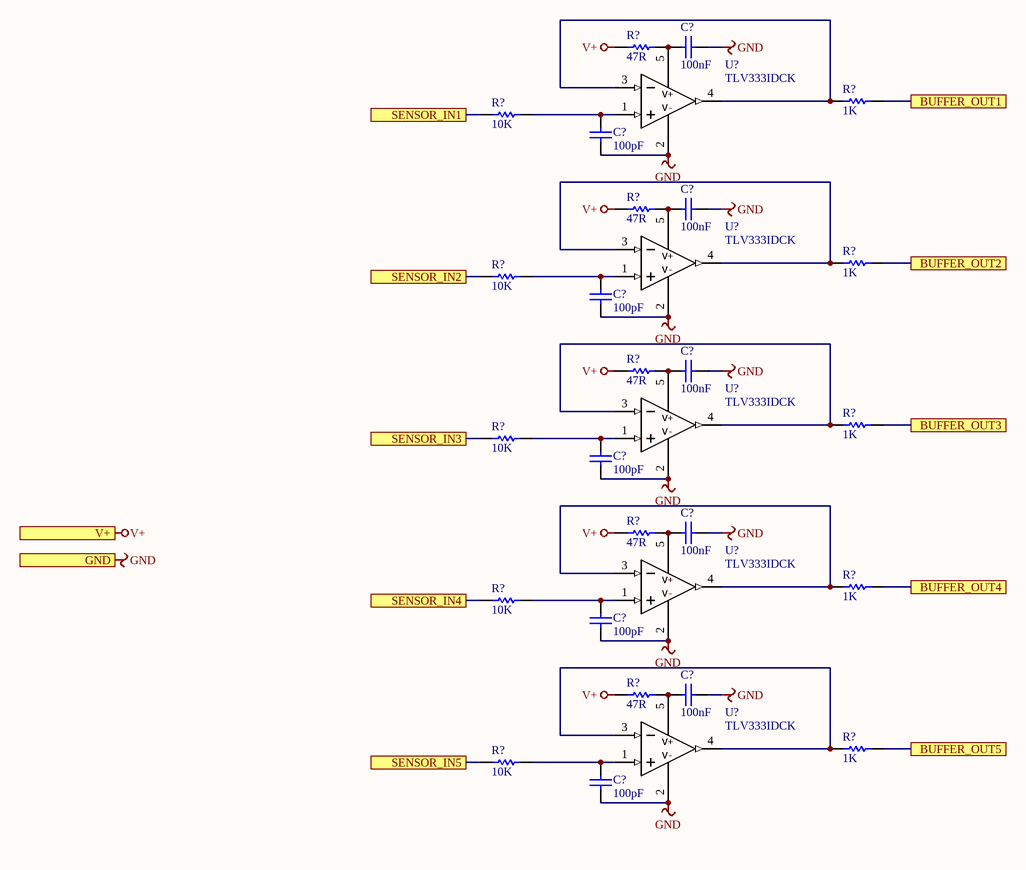
[diagram p5: AblationChannel.SchDoc]

### Parts
(Parts that share a designator on the sheet are numbered #1, #2 ... from top to bottom, then left to right.)
C?#7  100nF  [S0603C]
C?#8  100pF  [S0603C]
C?#9  100nF  [S0603C]
C?#10  100pF  [S0603C]
C?#11  100nF  [S0603C]
C?#12  100pF  [S0603C]
C?#13  100nF  [S0603C]
C?#14  100pF  [S0603C]
C?#15  100nF  [S0603C]
C?#16  100pF  [S0603C]
R?#17  47R  [S0603R]
R?#18  1K  [S0603R]
R?#19  10K  [S0603R]
R?#20  47R  [S0603R]
R?#21  1K  [S0603R]
R?#22  10K  [S0603R]
R?#23  47R  [S0603R]
R?#24  1K  [S0603R]
R?#25  10K  [S0603R]
R?#26  47R  [S0603R]
R?#27  1K  [S0603R]
R?#28  10K  [S0603R]
R?#29  47R  [S0603R]
R?#30  1K  [S0603R]
R?#31  10K  [S0603R]
U?#6  TLV333IDCK  [DCK0005A_N]
U?#7  TLV333IDCK  [DCK0005A_N]
U?#8  TLV333IDCK  [DCK0005A_N]
U?#9  TLV333IDCK  [DCK0005A_N]
U?#10  TLV333IDCK  [DCK0005A_N]

### Ports
BUFFER_OUT1, BUFFER_OUT2, BUFFER_OUT3, BUFFER_OUT4, BUFFER_OUT5, GND, SENSOR_IN1, SENSOR_IN2, SENSOR_IN3, SENSOR_IN4, SENSOR_IN5, V+

### Nets
GND: C?#7.1 C?#8.1 C?#9.1 C?#10.1 C?#11.1 C?#12.1 C?#13.1 C?#14.1 C?#15.1 C?#16.1 U?#6.2(V-) U?#7.2(V-) U?#8.2(V-) U?#9.2(V-) U?#10.2(V-) ; port GND
V+: R?#17.2 R?#20.2 R?#23.2 R?#26.2 R?#29.2 ; port V+
NetC?#7_2: C?#7.2 R?#17.1 U?#6.5(V+)
NetC?#8_2: C?#8.2 R?#19.2 U?#6.1(IN+)
NetC?#9_2: C?#9.2 R?#20.1 U?#7.5(V+)
NetC?#10_2: C?#10.2 R?#22.2 U?#7.1(IN+)
NetC?#11_2: C?#11.2 R?#23.1 U?#8.5(V+)
NetC?#12_2: C?#12.2 R?#25.2 U?#8.1(IN+)
NetC?#13_2: C?#13.2 R?#26.1 U?#9.5(V+)
NetC?#14_2: C?#14.2 R?#28.2 U?#9.1(IN+)
NetC?#15_2: C?#15.2 R?#29.1 U?#10.5(V+)
NetC?#16_2: C?#16.2 R?#31.2 U?#10.1(IN+)
NetR?#18_1: R?#18.1 U?#6.3(IN-) U?#6.4(OUT)
NetR?#18_2: R?#18.2 ; port BUFFER_OUT1
NetR?#19_1: R?#19.1 ; port SENSOR_IN1
NetR?#21_1: R?#21.1 U?#7.3(IN-) U?#7.4(OUT)
NetR?#21_2: R?#21.2 ; port BUFFER_OUT2
NetR?#22_1: R?#22.1 ; port SENSOR_IN2
NetR?#24_1: R?#24.1 U?#8.3(IN-) U?#8.4(OUT)
NetR?#24_2: R?#24.2 ; port BUFFER_OUT3
NetR?#25_1: R?#25.1 ; port SENSOR_IN3
NetR?#27_1: R?#27.1 U?#9.3(IN-) U?#9.4(OUT)
NetR?#27_2: R?#27.2 ; port BUFFER_OUT4
NetR?#28_1: R?#28.1 ; port SENSOR_IN4
NetR?#30_1: R?#30.1 U?#10.3(IN-) U?#10.4(OUT)
NetR?#30_2: R?#30.2 ; port BUFFER_OUT5
NetR?#31_1: R?#31.1 ; port SENSOR_IN5

### Library data of the parts
C?#7 C?#9 C?#11 C?#13 C?#15 = 100nF/0603/50V: as C?#1 on sheet Thermocouple channel; DistributorCode: C30926; Package: 0603
C?#8 C?#10 C?#12 C?#14 C?#16 = 100pF/0603/50V: 精度 ±5% / 容值 100pF / 额定电压 50V / 温漂系数（介质材料) C0G; Manufacturer: FH(风华); A_Manufacturer: 元六; Code: 0603CG101J500NT; A_Code: J CC41-0603-CG-50V-101J; CompType: Capacitor; A_ComType: 一类电容; DistributorCode: C1635; Package: 0603
R?#17 R?#20 R?#23 R?#26 R?#29 = 47R/0603: as R?#1 on sheet Thermocouple channel; DistributorCode: C140087; Package: 0603
R?#18 R?#21 R?#24 R?#27 R?#30 = 1K/0603: as R?#5 on sheet Battery_2CELL; DistributorCode: C115325; Package: 0603
R?#19 R?#22 R?#25 R?#28 R?#31 = 10K/0603: as R?#8 on sheet Battery_2CELL; DistributorCode: C115324; Package: 0603
U?#6-U?#10 = TLV333IDCK: 电源电压 1.8V ~ 5.5V, ±0.9V ~ 2.75V / 增益带宽积（GBP） 350kHz / 压摆率（SR） 0.16 V/us / 工作温度 -40°C ~ 125°C /; Manufacturer: TI(德州仪器); CompType: 运放; DistributorCode: C181502; Package: SC-70-5; Code: TLV333IDCK; A_Code: -; A_Manufacturer: -; A_ComType: -

## Sheet Analog.SchDoc
size A4